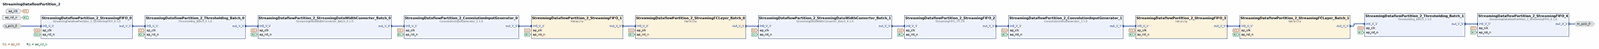
[diagram p0: block diagram of the top level, whole]
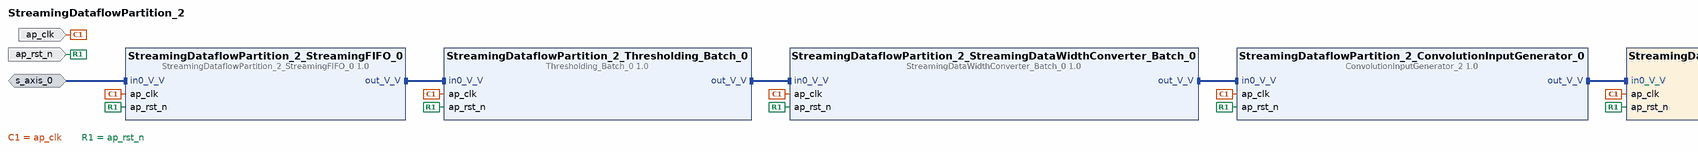
[diagram p1: block diagram of the top level, left part]
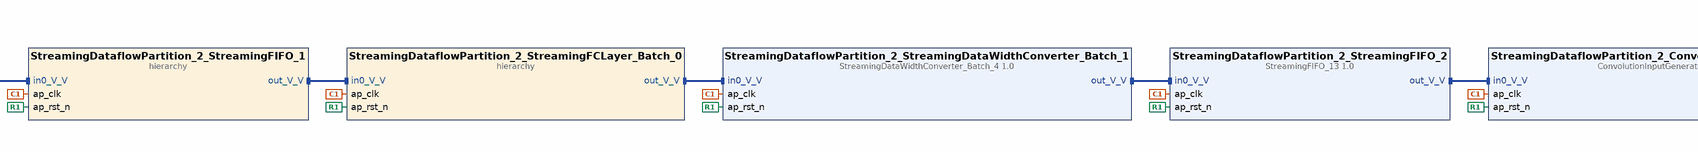
[diagram p2: block diagram of the top level, centre part]
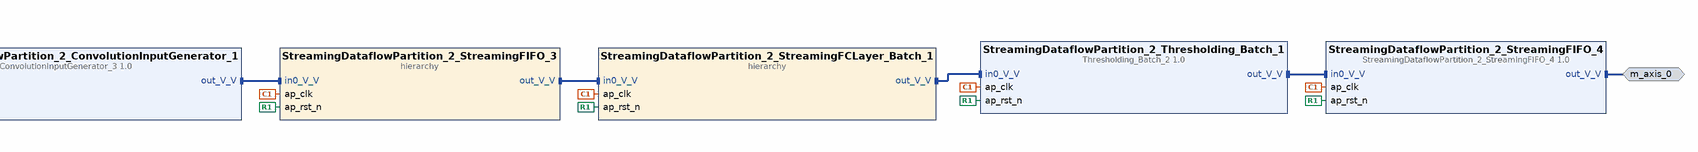
[diagram p3: block diagram of the top level, right part]
# Vivado block design StreamingDataflowPartition_2, xc7z020clg400-1, Vivado 2020.1.1
create_bd_design StreamingDataflowPartition_2

create_bd_intf_port -mode Slave -vlnv xilinx.com:interface:axis_rtl:1.0 s_axis_0
set_property -dict [list \
  CONFIG.TDATA_NUM_BYTES 1 \
  CONFIG.TDEST_WIDTH 0 \
  CONFIG.TID_WIDTH 0 \
  CONFIG.TUSER_WIDTH 0 \
  CONFIG.HAS_TREADY 1 \
  CONFIG.HAS_TSTRB 0 \
  CONFIG.HAS_TKEEP 0 \
  CONFIG.HAS_TLAST 0 \
  CONFIG.FREQ_HZ 100000000.000000 \
  CONFIG.LAYERED_METADATA undef \
] [get_bd_intf_ports s_axis_0]
create_bd_intf_port -mode Master -vlnv xilinx.com:interface:axis_rtl:1.0 m_axis_0
set_property -dict {CONFIG.FREQ_HZ 100000000.000000} [get_bd_intf_ports m_axis_0]
create_bd_port -dir I -type clk ap_clk
set_property -dict {CONFIG.FREQ_HZ 100000000.000000} [get_bd_ports ap_clk]
create_bd_port -dir I -type rst ap_rst_n

create_bd_cell -type ip -vlnv xilinx.com:hls:StreamingDataflowPartition_2_StreamingFIFO_0:1.0 StreamingDataflowPartition_2_StreamingFIFO_0
create_bd_cell -type ip -vlnv xilinx.com:hls:Thresholding_Batch_0:1.0 StreamingDataflowPartition_2_Thresholding_Batch_0
create_bd_cell -type ip -vlnv xilinx.com:hls:StreamingDataWidthConverter_Batch_0:1.0 StreamingDataflowPartition_2_StreamingDataWidthConverter_Batch_0
create_bd_cell -type ip -vlnv xilinx.com:hls:ConvolutionInputGenerator_2:1.0 StreamingDataflowPartition_2_ConvolutionInputGenerator_0
create_bd_cell -type hier StreamingDataflowPartition_2_StreamingFIFO_1
create_bd_cell -type hier StreamingDataflowPartition_2_StreamingFCLayer_Batch_0
create_bd_cell -type ip -vlnv xilinx.com:hls:StreamingDataWidthConverter_Batch_4:1.0 StreamingDataflowPartition_2_StreamingDataWidthConverter_Batch_1
create_bd_cell -type ip -vlnv xilinx.com:hls:StreamingFIFO_13:1.0 StreamingDataflowPartition_2_StreamingFIFO_2
create_bd_cell -type ip -vlnv xilinx.com:hls:ConvolutionInputGenerator_3:1.0 StreamingDataflowPartition_2_ConvolutionInputGenerator_1
create_bd_cell -type hier StreamingDataflowPartition_2_StreamingFIFO_3
create_bd_cell -type hier StreamingDataflowPartition_2_StreamingFCLayer_Batch_1
create_bd_cell -type ip -vlnv xilinx.com:hls:Thresholding_Batch_2:1.0 StreamingDataflowPartition_2_Thresholding_Batch_1
create_bd_cell -type ip -vlnv xilinx.com:hls:StreamingDataflowPartition_2_StreamingFIFO_4:1.0 StreamingDataflowPartition_2_StreamingFIFO_4

# ---- hierarchy /StreamingDataflowPartition_2_StreamingFIFO_1 ----
current_bd_instance /StreamingDataflowPartition_2_StreamingFIFO_1
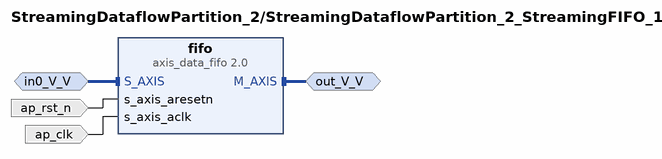
[diagram p4: block diagram inside /StreamingDataflowPartition_2_StreamingFIFO_1]
create_bd_intf_pin -mode Master -vlnv xilinx.com:interface:axis_rtl:1.0 out_V_V
create_bd_intf_pin -mode Slave -vlnv xilinx.com:interface:axis_rtl:1.0 in0_V_V
create_bd_pin -dir I -type clk ap_clk
create_bd_pin -dir I -type rst ap_rst_n

create_bd_cell -type ip -vlnv xilinx.com:ip:axis_data_fifo:2.0 fifo
set_property -dict {CONFIG.FIFO_DEPTH 512 CONFIG.FIFO_MEMORY_TYPE auto CONFIG.TDATA_NUM_BYTES 3} [get_bd_cells fifo]

# ---- hierarchy /StreamingDataflowPartition_2_StreamingFCLayer_Batch_0 ----
current_bd_instance /StreamingDataflowPartition_2_StreamingFCLayer_Batch_0
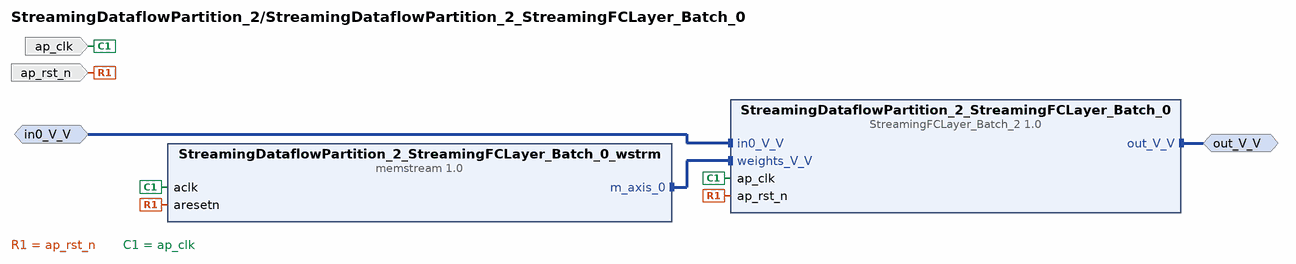
[diagram p5: block diagram inside /StreamingDataflowPartition_2_StreamingFCLayer_Batch_0]
create_bd_intf_pin -mode Master -vlnv xilinx.com:interface:axis_rtl:1.0 out_V_V
create_bd_intf_pin -mode Slave -vlnv xilinx.com:interface:axis_rtl:1.0 in0_V_V
create_bd_pin -dir I -type clk ap_clk
create_bd_pin -dir I -type rst ap_rst_n

create_bd_cell -type ip -vlnv xilinx.com:hls:StreamingFCLayer_Batch_2:1.0 StreamingDataflowPartition_2_StreamingFCLayer_Batch_0
create_bd_cell -type ip -vlnv xilinx.com:user:memstream:1.0 StreamingDataflowPartition_2_StreamingFCLayer_Batch_0_wstrm
set_property -dict [list \
  CONFIG.MEM_DEPTH 144 \
  CONFIG.MEM_INIT /home/grgov/Diplomski_rad/finn_modified_docker_output_dir/code_gen_ipgen_StreamingFCLayer_Batch_2_zoujzpy3/ \
  CONFIG.MEM_WIDTH 48 \
  CONFIG.NSTREAMS 1 \
  CONFIG.RAM_STYLE auto \
  CONFIG.STRM0_DEPTH 144 \
  CONFIG.STRM0_OFFSET 0 \
  CONFIG.STRM0_WIDTH 48 \
] [get_bd_cells StreamingDataflowPartition_2_StreamingFCLayer_Batch_0_wstrm]

# ---- hierarchy /StreamingDataflowPartition_2_StreamingFIFO_3 ----
current_bd_instance /StreamingDataflowPartition_2_StreamingFIFO_3
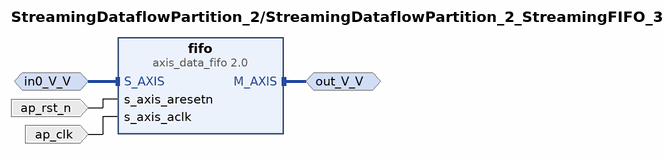
[diagram p6: block diagram inside /StreamingDataflowPartition_2_StreamingFIFO_3]
create_bd_intf_pin -mode Master -vlnv xilinx.com:interface:axis_rtl:1.0 out_V_V
create_bd_intf_pin -mode Slave -vlnv xilinx.com:interface:axis_rtl:1.0 in0_V_V
create_bd_pin -dir I -type clk ap_clk
create_bd_pin -dir I -type rst ap_rst_n

create_bd_cell -type ip -vlnv xilinx.com:ip:axis_data_fifo:2.0 fifo
set_property -dict {CONFIG.FIFO_DEPTH 2048 CONFIG.FIFO_MEMORY_TYPE auto CONFIG.TDATA_NUM_BYTES 4} [get_bd_cells fifo]

# ---- hierarchy /StreamingDataflowPartition_2_StreamingFCLayer_Batch_1 ----
current_bd_instance /StreamingDataflowPartition_2_StreamingFCLayer_Batch_1
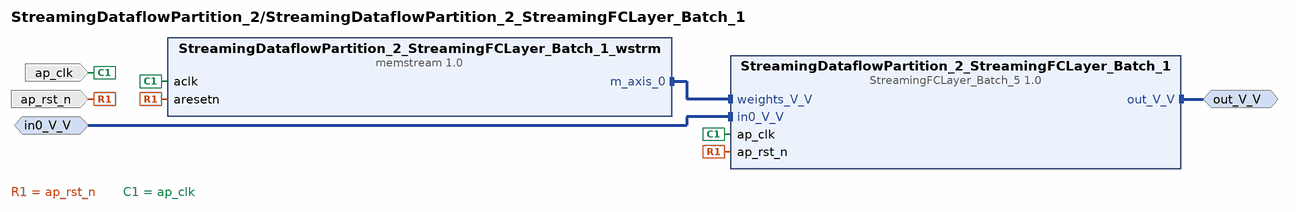
[diagram p7: block diagram inside /StreamingDataflowPartition_2_StreamingFCLayer_Batch_1]
create_bd_intf_pin -mode Master -vlnv xilinx.com:interface:axis_rtl:1.0 out_V_V
create_bd_intf_pin -mode Slave -vlnv xilinx.com:interface:axis_rtl:1.0 in0_V_V
create_bd_pin -dir I -type clk ap_clk
create_bd_pin -dir I -type rst ap_rst_n

create_bd_cell -type ip -vlnv xilinx.com:hls:StreamingFCLayer_Batch_5:1.0 StreamingDataflowPartition_2_StreamingFCLayer_Batch_1
create_bd_cell -type ip -vlnv xilinx.com:user:memstream:1.0 StreamingDataflowPartition_2_StreamingFCLayer_Batch_1_wstrm
set_property -dict [list \
  CONFIG.MEM_DEPTH 4608 \
  CONFIG.MEM_INIT /home/grgov/Diplomski_rad/finn_modified_docker_output_dir/code_gen_ipgen_StreamingFCLayer_Batch_5_rxclvy1e/ \
  CONFIG.MEM_WIDTH 32 \
  CONFIG.NSTREAMS 1 \
  CONFIG.RAM_STYLE auto \
  CONFIG.STRM0_DEPTH 4608 \
  CONFIG.STRM0_OFFSET 0 \
  CONFIG.STRM0_WIDTH 32 \
] [get_bd_cells StreamingDataflowPartition_2_StreamingFCLayer_Batch_1_wstrm]

# ---- connections ----

current_bd_instance /StreamingDataflowPartition_2_StreamingFIFO_1
connect_bd_intf_net [get_bd_intf_pins out_V_V] [get_bd_intf_pins fifo/M_AXIS]
connect_bd_intf_net [get_bd_intf_pins in0_V_V] [get_bd_intf_pins fifo/S_AXIS]
connect_bd_net [get_bd_pins ap_rst_n] [get_bd_pins fifo/s_axis_aresetn]
connect_bd_net [get_bd_pins ap_clk] [get_bd_pins fifo/s_axis_aclk]

current_bd_instance /StreamingDataflowPartition_2_StreamingFCLayer_Batch_0
connect_bd_intf_net [get_bd_intf_pins out_V_V] [get_bd_intf_pins StreamingDataflowPartition_2_StreamingFCLayer_Batch_0/out_V_V]
connect_bd_intf_net [get_bd_intf_pins in0_V_V] [get_bd_intf_pins StreamingDataflowPartition_2_StreamingFCLayer_Batch_0/in0_V_V]
connect_bd_intf_net [get_bd_intf_pins StreamingDataflowPartition_2_StreamingFCLayer_Batch_0_wstrm/m_axis_0] [get_bd_intf_pins StreamingDataflowPartition_2_StreamingFCLayer_Batch_0/weights_V_V]
connect_bd_net [get_bd_pins ap_rst_n] \
  [get_bd_pins StreamingDataflowPartition_2_StreamingFCLayer_Batch_0_wstrm/aresetn] \
  [get_bd_pins StreamingDataflowPartition_2_StreamingFCLayer_Batch_0/ap_rst_n]
connect_bd_net [get_bd_pins ap_clk] \
  [get_bd_pins StreamingDataflowPartition_2_StreamingFCLayer_Batch_0_wstrm/aclk] \
  [get_bd_pins StreamingDataflowPartition_2_StreamingFCLayer_Batch_0/ap_clk]

current_bd_instance /StreamingDataflowPartition_2_StreamingFIFO_3
connect_bd_intf_net [get_bd_intf_pins out_V_V] [get_bd_intf_pins fifo/M_AXIS]
connect_bd_intf_net [get_bd_intf_pins in0_V_V] [get_bd_intf_pins fifo/S_AXIS]
connect_bd_net [get_bd_pins ap_rst_n] [get_bd_pins fifo/s_axis_aresetn]
connect_bd_net [get_bd_pins ap_clk] [get_bd_pins fifo/s_axis_aclk]

current_bd_instance /StreamingDataflowPartition_2_StreamingFCLayer_Batch_1
connect_bd_intf_net [get_bd_intf_pins StreamingDataflowPartition_2_StreamingFCLayer_Batch_1_wstrm/m_axis_0] [get_bd_intf_pins StreamingDataflowPartition_2_StreamingFCLayer_Batch_1/weights_V_V]
connect_bd_intf_net [get_bd_intf_pins in0_V_V] [get_bd_intf_pins StreamingDataflowPartition_2_StreamingFCLayer_Batch_1/in0_V_V]
connect_bd_intf_net [get_bd_intf_pins out_V_V] [get_bd_intf_pins StreamingDataflowPartition_2_StreamingFCLayer_Batch_1/out_V_V]
connect_bd_net [get_bd_pins ap_rst_n] \
  [get_bd_pins StreamingDataflowPartition_2_StreamingFCLayer_Batch_1_wstrm/aresetn] \
  [get_bd_pins StreamingDataflowPartition_2_StreamingFCLayer_Batch_1/ap_rst_n]
connect_bd_net [get_bd_pins ap_clk] \
  [get_bd_pins StreamingDataflowPartition_2_StreamingFCLayer_Batch_1_wstrm/aclk] \
  [get_bd_pins StreamingDataflowPartition_2_StreamingFCLayer_Batch_1/ap_clk]

current_bd_instance /
connect_bd_intf_net -intf_net in0_V_V_0_1 [get_bd_intf_ports s_axis_0] [get_bd_intf_pins StreamingDataflowPartition_2_StreamingFIFO_0/in0_V_V]
connect_bd_intf_net [get_bd_intf_pins StreamingDataflowPartition_2_StreamingFIFO_0/out_V_V] [get_bd_intf_pins StreamingDataflowPartition_2_Thresholding_Batch_0/in0_V_V]
connect_bd_intf_net [get_bd_intf_pins StreamingDataflowPartition_2_Thresholding_Batch_0/out_V_V] [get_bd_intf_pins StreamingDataflowPartition_2_StreamingDataWidthConverter_Batch_0/in0_V_V]
connect_bd_intf_net [get_bd_intf_pins StreamingDataflowPartition_2_StreamingDataWidthConverter_Batch_0/out_V_V] [get_bd_intf_pins StreamingDataflowPartition_2_ConvolutionInputGenerator_0/in0_V_V]
connect_bd_intf_net [get_bd_intf_pins StreamingDataflowPartition_2_ConvolutionInputGenerator_0/out_V_V] [get_bd_intf_pins StreamingDataflowPartition_2_StreamingFIFO_1/in0_V_V]
connect_bd_intf_net [get_bd_intf_pins StreamingDataflowPartition_2_StreamingFIFO_1/out_V_V] [get_bd_intf_pins StreamingDataflowPartition_2_StreamingFCLayer_Batch_0/in0_V_V]
connect_bd_intf_net [get_bd_intf_pins StreamingDataflowPartition_2_StreamingFCLayer_Batch_0/out_V_V] [get_bd_intf_pins StreamingDataflowPartition_2_StreamingDataWidthConverter_Batch_1/in0_V_V]
connect_bd_intf_net [get_bd_intf_pins StreamingDataflowPartition_2_StreamingDataWidthConverter_Batch_1/out_V_V] [get_bd_intf_pins StreamingDataflowPartition_2_StreamingFIFO_2/in0_V_V]
connect_bd_intf_net [get_bd_intf_pins StreamingDataflowPartition_2_StreamingFIFO_2/out_V_V] [get_bd_intf_pins StreamingDataflowPartition_2_ConvolutionInputGenerator_1/in0_V_V]
connect_bd_intf_net [get_bd_intf_pins StreamingDataflowPartition_2_ConvolutionInputGenerator_1/out_V_V] [get_bd_intf_pins StreamingDataflowPartition_2_StreamingFIFO_3/in0_V_V]
connect_bd_intf_net [get_bd_intf_pins StreamingDataflowPartition_2_StreamingFIFO_3/out_V_V] [get_bd_intf_pins StreamingDataflowPartition_2_StreamingFCLayer_Batch_1/in0_V_V]
connect_bd_intf_net [get_bd_intf_pins StreamingDataflowPartition_2_StreamingFCLayer_Batch_1/out_V_V] [get_bd_intf_pins StreamingDataflowPartition_2_Thresholding_Batch_1/in0_V_V]
connect_bd_intf_net [get_bd_intf_pins StreamingDataflowPartition_2_Thresholding_Batch_1/out_V_V] [get_bd_intf_pins StreamingDataflowPartition_2_StreamingFIFO_4/in0_V_V]
connect_bd_intf_net [get_bd_intf_ports m_axis_0] [get_bd_intf_pins StreamingDataflowPartition_2_StreamingFIFO_4/out_V_V]
connect_bd_net -net ap_clk_0_1 [get_bd_ports ap_clk] \
  [get_bd_pins StreamingDataflowPartition_2_StreamingFIFO_0/ap_clk] \
  [get_bd_pins StreamingDataflowPartition_2_Thresholding_Batch_0/ap_clk] \
  [get_bd_pins StreamingDataflowPartition_2_StreamingDataWidthConverter_Batch_0/ap_clk] \
  [get_bd_pins StreamingDataflowPartition_2_ConvolutionInputGenerator_0/ap_clk] \
  [get_bd_pins StreamingDataflowPartition_2_StreamingFIFO_1/ap_clk] \
  [get_bd_pins StreamingDataflowPartition_2_StreamingFCLayer_Batch_0/ap_clk] \
  [get_bd_pins StreamingDataflowPartition_2_StreamingDataWidthConverter_Batch_1/ap_clk] \
  [get_bd_pins StreamingDataflowPartition_2_StreamingFIFO_2/ap_clk] \
  [get_bd_pins StreamingDataflowPartition_2_ConvolutionInputGenerator_1/ap_clk] \
  [get_bd_pins StreamingDataflowPartition_2_StreamingFIFO_3/ap_clk] \
  [get_bd_pins StreamingDataflowPartition_2_StreamingFCLayer_Batch_1/ap_clk] \
  [get_bd_pins StreamingDataflowPartition_2_Thresholding_Batch_1/ap_clk] \
  [get_bd_pins StreamingDataflowPartition_2_StreamingFIFO_4/ap_clk]
connect_bd_net -net ap_rst_n_0_1 [get_bd_ports ap_rst_n] \
  [get_bd_pins StreamingDataflowPartition_2_StreamingFIFO_0/ap_rst_n] \
  [get_bd_pins StreamingDataflowPartition_2_Thresholding_Batch_0/ap_rst_n] \
  [get_bd_pins StreamingDataflowPartition_2_StreamingDataWidthConverter_Batch_0/ap_rst_n] \
  [get_bd_pins StreamingDataflowPartition_2_ConvolutionInputGenerator_0/ap_rst_n] \
  [get_bd_pins StreamingDataflowPartition_2_StreamingFIFO_1/ap_rst_n] \
  [get_bd_pins StreamingDataflowPartition_2_StreamingFCLayer_Batch_0/ap_rst_n] \
  [get_bd_pins StreamingDataflowPartition_2_StreamingDataWidthConverter_Batch_1/ap_rst_n] \
  [get_bd_pins StreamingDataflowPartition_2_StreamingFIFO_2/ap_rst_n] \
  [get_bd_pins StreamingDataflowPartition_2_ConvolutionInputGenerator_1/ap_rst_n] \
  [get_bd_pins StreamingDataflowPartition_2_StreamingFIFO_3/ap_rst_n] \
  [get_bd_pins StreamingDataflowPartition_2_StreamingFCLayer_Batch_1/ap_rst_n] \
  [get_bd_pins StreamingDataflowPartition_2_Thresholding_Batch_1/ap_rst_n] \
  [get_bd_pins StreamingDataflowPartition_2_StreamingFIFO_4/ap_rst_n]

validate_bd_design
save_bd_design
